# Altium project Robosub_PCB_thruster_board.PrjPcb
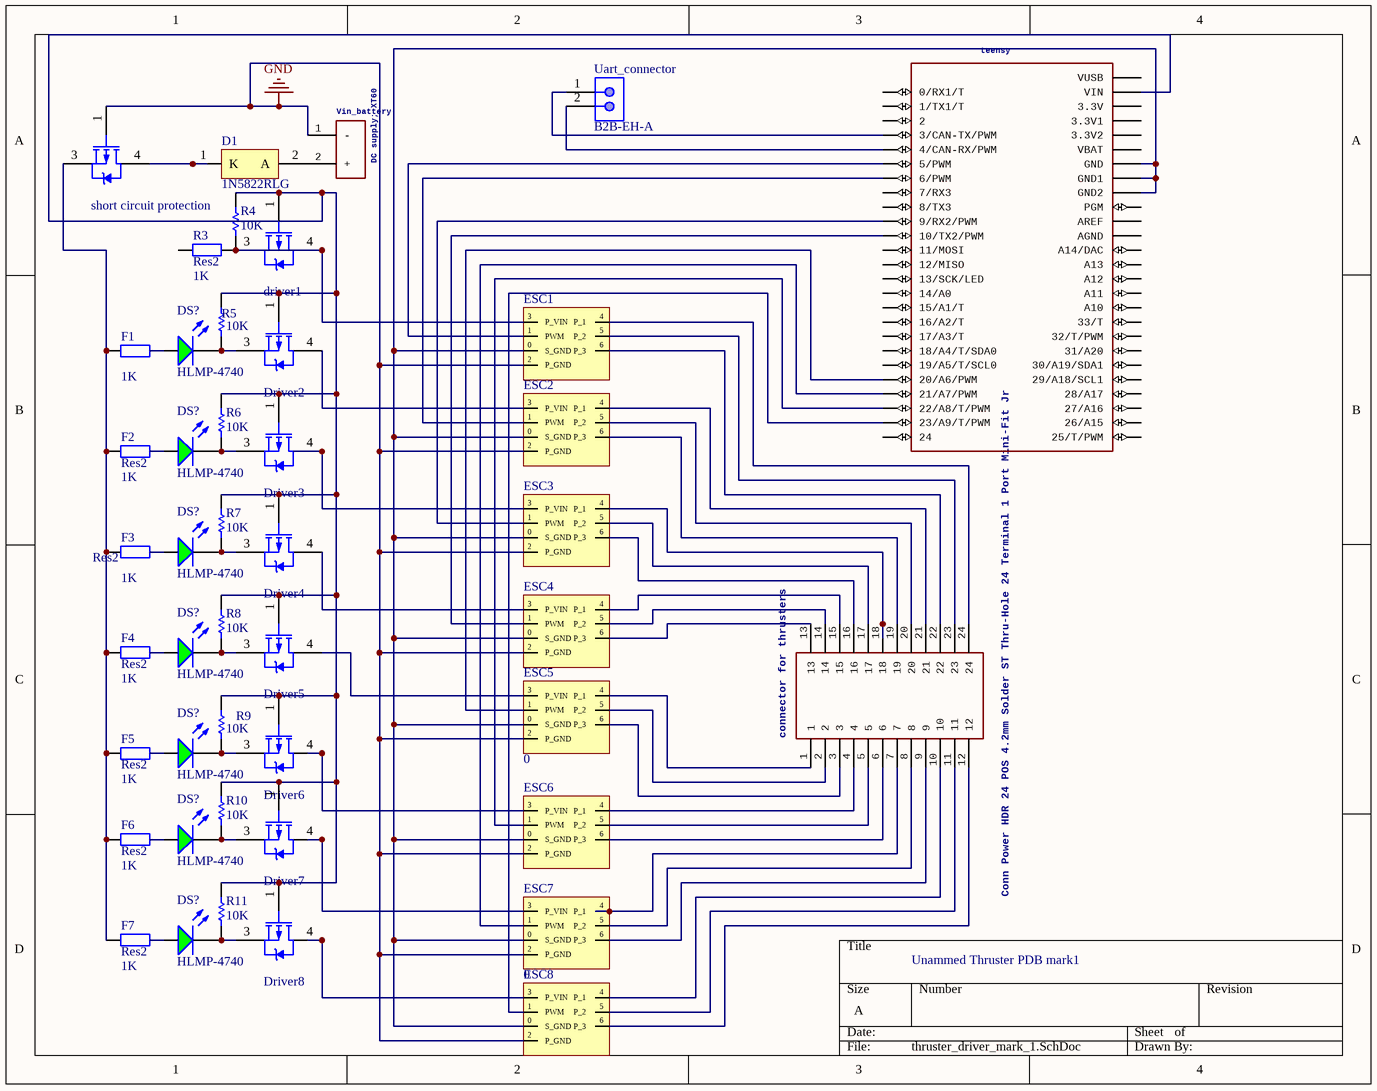
[diagram p0: thruster_driver_mark_1.SchDoc]
1 sheet, 45 parts. Net scope: global (net labels, ports and power ports of the same name join across sheets).
Board files: Thruster_driver_mark1.PcbDoc, Thruster_driver_mark2.PcbDoc

## Sheet thruster_driver_mark_1.SchDoc
size A

### Parts
(Parts that share a designator on the sheet are numbered #1, #2 ... from top to bottom, then left to right.)
connector_for_thrusters  Conn Power HDR 24 POS 4.2mm Solder ST Thru-Hole 24 Terminal 1 Port Mini-Fit Jr  [MOLEX_0039281243]
D1  1N5822RLG  [ONSC-AXIAL_LEAD-2-267-05_V]
driver1  MOSFET  [ONSC-DPAK-3-369C-01_V]  (value not drawn)
Driver2  MOSFET  [ONSC-DPAK-3-369C-01_V]  (value not drawn)
Driver3  MOSFET  [ONSC-DPAK-3-369C-01_V]  (value not drawn)
Driver4  MOSFET  [ONSC-DPAK-3-369C-01_V]  (value not drawn)
Driver5  MOSFET  [ONSC-DPAK-3-369C-01_V]  (value not drawn)
Driver6  MOSFET  [ONSC-DPAK-3-369C-01_V]  (value not drawn)
Driver7  MOSFET  [ONSC-DPAK-3-369C-01_V]  (value not drawn)
Driver8  MOSFET  [ONSC-DPAK-3-369C-01_V]  (value not drawn)
DS?#1  HLMP-4740  [AVAG-HLMP-4740]
DS?#2  HLMP-4740  [AVAG-HLMP-4740]
DS?#3  HLMP-4740  [AVAG-HLMP-4740]
DS?#4  HLMP-4740  [AVAG-HLMP-4740]
DS?#5  HLMP-4740  [AVAG-HLMP-4740]
DS?#6  HLMP-4740  [AVAG-HLMP-4740]
DS?#7  HLMP-4740  [AVAG-HLMP-4740]
ESC1  (no value)  [PCBComponent_1]
ESC2  (no value)  [PCBComponent_1]
ESC3  (no value)  [PCBComponent_1]
ESC4  (no value)  [PCBComponent_1]
ESC5  0  [PCBComponent_1]
ESC6  (no value)  [PCBComponent_1]
ESC7  0  [PCBComponent_1]
ESC8  (no value)  [PCBComponent_1]
F1  value 1K  [AXIAL-0.4]  (hidden comment: Fuse)
F2  Res2  value 1K  [AXIAL-0.4]
F3  Res2  value 1K  [AXIAL-0.4]
F4  Res2  value 1K  [AXIAL-0.4]
F5  Res2  value 1K  [AXIAL-0.4]
F6  Res2  value 1K  [AXIAL-0.4]
F7  Res2  value 1K  [AXIAL-0.4]
R3  Res2  value 1K  [AXIAL-0.4]
R4  10K  [RESC1609X55X30NL10T20]
R5  10K  [RESC1609X55X30NL10T20]
R6  10K  [RESC1609X55X30NL10T20]
R7  10K  [RESC1609X55X30NL10T20]
R8  10K  [RESC1609X55X30NL10T20]
R9  10K  [RESC1609X55X30NL10T20]
R10  10K  [RESC1609X55X30NL10T20]
R11  10K  [RESC1609X55X30NL10T20]
short_circuit_protection  MOSFET  [ONSC-DPAK-3-369C-01_V]  (value not drawn)
teensy  Footprint for Teensy 3.1 or 3.2 board using all pads and all through-holes. Pads need a 2x7 0.1" SMD header.  [TEENSY_3.0-3.2_ALL_PINS_&_PADS]  (value not drawn)
Uart_connector  B2B-EH-A  [JST-B2B-EH-A_V]
Vin_battery  DC supply; XT60  [AMASS_XT60-M]

### Nets
GND: ESC1.2(P_GND) ESC2.2(P_GND) ESC3.2(P_GND) ESC4.2(P_GND) ESC5.2(P_GND) ESC6.2(P_GND) ESC7.2(P_GND) ESC8.2(P_GND) short_circuit_protection.1(G) Vin_battery.1(-)
Netconnector_for_thrusters_1: connector_for_thrusters.1 ESC5.4(P_1)
Netconnector_for_thrusters_2: connector_for_thrusters.2 ESC5.5(P_2)
Netconnector_for_thrusters_3: connector_for_thrusters.3 ESC5.6(P_3)
Netconnector_for_thrusters_4: connector_for_thrusters.4 ESC6.4(P_1)
Netconnector_for_thrusters_5: connector_for_thrusters.5 ESC6.5(P_2)
Netconnector_for_thrusters_6: connector_for_thrusters.6 ESC6.6(P_3)
Netconnector_for_thrusters_7: connector_for_thrusters.7 ESC7.4(P_1)
Netconnector_for_thrusters_8: connector_for_thrusters.8 ESC7.5(P_2)
Netconnector_for_thrusters_9: connector_for_thrusters.9 ESC7.6(P_3)
Netconnector_for_thrusters_10: connector_for_thrusters.10 ESC8.4(P_1)
Netconnector_for_thrusters_11: connector_for_thrusters.11 ESC8.5(P_2)
Netconnector_for_thrusters_12: connector_for_thrusters.12 ESC8.6(P_3)
Netconnector_for_thrusters_13: connector_for_thrusters.13 ESC4.6(P_3)
Netconnector_for_thrusters_14: connector_for_thrusters.14 ESC4.5(P_2)
Netconnector_for_thrusters_15: connector_for_thrusters.15 ESC4.4(P_1)
Netconnector_for_thrusters_16: connector_for_thrusters.16 ESC3.6(P_3)
Netconnector_for_thrusters_17: connector_for_thrusters.17 ESC3.5(P_2)
Netconnector_for_thrusters_18: connector_for_thrusters.18 ESC3.4(P_1)
Netconnector_for_thrusters_19: connector_for_thrusters.19 ESC2.6(P_3)
Netconnector_for_thrusters_20: connector_for_thrusters.20 ESC2.5(P_2)
Netconnector_for_thrusters_21: connector_for_thrusters.21 ESC2.4(P_1)
Netconnector_for_thrusters_22: connector_for_thrusters.22 ESC1.6(P_3)
Netconnector_for_thrusters_23: connector_for_thrusters.23 ESC1.5(P_2)
Netconnector_for_thrusters_24: connector_for_thrusters.24 ESC1.4(P_1)
NetD1_1: D1.1(K) short_circuit_protection.4(D)
NetD1_2: D1.2(A) Vin_battery.2(+)
Netdriver1_1: driver1.1(G) Driver2.1(G) Driver3.1(G) Driver4.1(G) Driver5.1(G) Driver6.1(G) Driver7.1(G) Driver8.1(G) R4.1 R5.1 R6.1 R7.1 R8.1 R9.1 R10.1 R11.1 teensy.VIN
Netdriver1_3: driver1.3(S) driver1.4(D) ESC1.3(P_VIN) R3.2 R4.2
NetDriver2_3: Driver2.3(S) DS?#1.2(K) R5.2
NetDriver2_4: Driver2.4(D) ESC2.3(P_VIN)
NetDriver3_3: Driver3.3(S) DS?#2.2(K) R6.2
NetDriver3_4: Driver3.4(D) ESC3.3(P_VIN)
NetDriver4_3: Driver4.3(S) DS?#3.2(K) R7.2
NetDriver4_4: Driver4.4(D) ESC4.3(P_VIN)
NetDriver5_3: Driver5.3(S) DS?#4.2(K) R8.2
NetDriver5_4: Driver5.4(D) ESC5.3(P_VIN)
NetDriver6_3: Driver6.3(S) DS?#5.2(K) R9.2
NetDriver6_4: Driver6.4(D) ESC6.3(P_VIN)
NetDriver7_3: Driver7.3(S) DS?#6.2(K) R10.2
NetDriver7_4: Driver7.4(D) ESC7.3(P_VIN)
NetDriver8_3: Driver8.3(S) DS?#7.2(K) R11.2
NetDriver8_4: Driver8.4(D) ESC8.3(P_VIN)
NetDS?#1_1: DS?#1.1(A) F1.2
NetDS?#2_1: DS?#2.1(A) F2.2
NetDS?#3_1: DS?#3.1(A) F3.2
NetDS?#4_1: DS?#4.1(A) F4.2
NetDS?#5_1: DS?#5.1(A) F5.2
NetDS?#6_1: DS?#6.1(A) F6.2
NetDS?#7_1: DS?#7.1(A) F7.2
NetESC1_0: ESC1.0(S_GND) ESC2.0(S_GND) ESC3.0(S_GND) ESC4.0(S_GND) ESC5.0(S_GND) ESC6.0(S_GND) ESC7.0(S_GND) ESC8.0(S_GND) teensy.GND teensy.GND1 teensy.GND2
NetESC1_1: ESC1.1(PWM) teensy.5(5/PWM)
NetESC2_1: ESC2.1(PWM) teensy.6(6/PWM)
NetESC3_1: ESC3.1(PWM) teensy.9(9/RX2/PWM)
NetESC4_1: ESC4.1(PWM) teensy.10(10/TX2/PWM)
NetESC5_1: ESC5.1(PWM) teensy.20/A6(20/A6/PWM)
NetESC6_1: ESC6.1(PWM) teensy.22/A8(22/A8/T/PWM)
NetESC7_1: ESC7.1(PWM) teensy.21/A7(21/A7/PWM)
NetESC8_1: ESC8.1(PWM) teensy.23/A9(23/A9/T/PWM)
NetF1_1: F1.1 F2.1 F3.1 F4.1 F5.1 F6.1 F7.1 short_circuit_protection.3(S)
Netteensy_3: teensy.3(3/CAN-TX/PWM) Uart_connector.1
Netteensy_4: teensy.4(4/CAN-RX/PWM) Uart_connector.2

Not connected (* = marked no-connect by the designer): R3 1; teensy 0(0/RX1/T) 1(1/TX1/T) 2 3.3V1 (3.3V1) 3.3V2 3.3V (3.3V) 7(7/RX3) 8(8/TX3) 11(11/MOSI) 12(12/MISO) 13(13/SCK/LED) 14/A0 15/A1(15/A1/T) 16/A2(16/A2/T) 17/A3(17/A3/T) 18/A4(18/A4/T/SDA0) 19/A5(19/A5/T/SCL0) 24 25(25/T/PWM) 26(26/A15) 27(27/A16) 28(28/A17) 29(29/A18/SCL1) 30(30/A19/SDA1) 31(31/A20) 32(32/T/PWM) 33(33/T) A10 A11 A12 A13 AGND AREF PGM RESET/DAC(A14/DAC) VBAT VUSB

### Notes on the sheet
- Unammed Thruster PDB mark1

### Library data of the parts
connector_for_thrusters = 0039281243: GateName_1: G$1; MF: Molex; SymbolName_1: 0039281243; LibraryName: 0039281243; DeviceSetName: 0039281243; Package: MOLEX_0039281243; DIGI-KEY_PART_NUMBER: WM3811-ND; DIGI-KEY_PURCHASE_URL: https://www.digikey.com/product-detail/en/molex/0039281243/WM3811-ND/356033?utm_source=snapeda&utm_medium=aggregator&utm_campaign=symbol; MP: 0039281243; PACKAGE: None
D1 = CMP-1055-00010-1: Rectifier, 2-Pin Axial_Lead, Pb-Free, Tape and Reel; Manufacturer: On Semiconductor; Configuration: Single; IFSM Max (A): 80; ComponentLink2URL: http://www.onsemi.cn/pub_link/Collateral/1N5820-D.PDF; Packing: Tape and Reel; ComponentLink1Description: Manufacturer URL; PackageDescription: 2-Pin, Axial Lead, Diameter 5.05 mm; ComponentLink3Description: Package Specification; PackageReference: AXIAL_LEAD-2-267-05; PartNumber: 1N5822RLG; PackageVersion: Rev. G, 06/2000; ComponentLink1URL: http://www.onsemi.com/; ComponentLink2Description: Datasheet; RoHS: TRUE; Mounting Technology: Through Hole; DatasheetVersion: Rev. 10; ComponentLink3URL: http://www.onsemi.com/pub_link/Collateral/267-05.PDF
driver1 Driver2-Driver8 short_circuit_protection = CMP-1058-00407-1: Power MOSFET -60 V, -15.5 A, Single P-Channel, 3-Pin DPAK, Pb-Free, Tape and Reel; PartNumber: NTD20P06LT4G; Manufacturer: On Semiconductor; V(BR)DSS Min (V): 60; Channel Polarity: P Channel; VGS Max (V): 20; Ciss Typ (pF): 740; ID Max (A): 15.5; PD Max (W): 65; Coss Typ (pF): 207; VGS(th) Max (V): 2; Qrr Typ (nC): 0.13; Crss Typ (pF): 66; ComponentLink1URL: http://www.onsemi.com/; ComponentLink1Description: Manufacturer URL; Configuration: Single; ComponentLink2URL: http://www.onsemi.cn/pub_link/Collateral/NTD20P06L-D.PDF; ComponentLink3Description: Package Specification; Mounting Technology: Surface Mount; RoHS: Pb-Free; ComponentLink3URL: http://www.onsemi.cn/pub_link/Collateral/369C.PDF; PackageVersion: Rev. E, 02/2014; Packing: Tape and Reel; DatasheetVersion: Rev. 6; PackageReference: DPAK-3-369C-01; PackageDescription: 3-Pin Flange Mount, Body 6.54 x 6.095 mm, Pitch 2.29 mm; ComponentLink2Description: Datasheet; Package Type: DPAK-3
DS?#1-DS?#7 = CMP-2000-06413-1: T-1 3/4 (5 mm) Low Current LED Lamp, Green, 1.9 V, -20 to 100 degC, 2-Pin THD, RoHS, Bulk; Manufacturer: AvagoTechnologies; Type: Uni-Color; Peak Wavelength: 565nm; Rad Hard: No; Viewing Angle: 50°; Dominant Wavelength/Color Temperature: 569nm; Number of LEDs: 1; Lens Appearance: ColoredDiffused; Lens Shape Type: Circular; Mounting Orientation: TopMount; Intensity: 2.3mcd; Datasheet Version: 07/2014; Category: LEDs; Datasheet URL: http://docs.avagotech.com/docs/AV02-1557EN; Packaging: Bulk; Pin Count: 2; Mounting Technology: ThroughHole; Package Reference: HLMP-4740; Mounting: ThroughHole; Manufacturer URL: http://www.avagotech.com/; Color: Green; Package: 2T-13/4; Package Description: 2-Pin Through Hole Device, Dia 5.845 mm, Pitch 2.54 mm
ESC1-ESC8 = ESC_1: this is just a footprint made for the esc to allow a interface, where the esc can be on the board
F1-F7 R3 = Res2: Resistor; Published: 8-Jun-2000; LatestRevisionDate: 17-Jul-2002; LatestRevisionNote: Re-released for DXP Platform.; PackageReference: AXIAL-0.4; Publisher: Altium Limited; PackageDescription: Axial Device, Thru-Hole; 2 Leads; 0.4 in Pin Spacing
R4-R11 = CMP-2000-03691-1: Manufacturer: Vishay Dale; Part Number: TNPW060310K0BEEA
teensy = TEENSY_3.1-3.2_ALL_PINS&PADS: GateName_1: G$1; SymbolName_1: TEENSY_3.1-3.2_ALL_PINS_AND_PADS; LibraryName: Teensy_3_and_LC_Series_Boards_v1.4; DeviceSetName: TEENSY_3.1-3.2_ALL_PINS&PADS; Package: TEENSY_3.0-3.2_ALL_PINS_&_PADS
Uart_connector = CMP-2000-05887-1: Male Header, Pitch 2.5 mm, 1 x 2 Position, Height 6 mm, Tail Length 3.2 mm, -25 to 85 degC, RoHS, Bulk; Manufacturer: JST; Other Names: 455-1014; Mating Products: 455-1000-ND-CONNHOUSINGEH2POS2.5MMCRIMP455-2933-ND-CONNRECEPTHR2POS2.5MMBLACK455-2934-ND-CONNRECEPTHR2POS2.5MMWHITE455-1044-ND-CONNRECEPTHR2POS2.5MMWHITE455-1057-ND-CONNRECEPTHR2POS2.5MMBLACK; Pitch: 0.098"(2.50mm); Connector Type: Header,Shrouded; Number of Positions: 2; Number of Positions Loaded: All; Manufacturer URL: http://www.jst.com/home2.html; Contact Type: MalePin; Package Description: Male Header, Pitch 2.5 mm, 1 x 2 Position, Height 6 mm, Tail Length 3.2 mm; Mounting Type: ThroughHole; Mounting Technology: ThroughHole; Number of Rows: 1; Features: -; Fastening Type: DetentLock; Contact Finish Thickness: -; Datasheet Version: 10/2002; Termination: Press-Fit; Datasheet URL: http://media.digikey.com/pdf/Data%20Sheets/JST%20PDFs/EH%20Series.pdf; Standard Package: 1,000; Category: Connectors,Interconnects; Family: RectangularConnectors-Headers,MalePins; Contact Finish: Tin-Lead; Packaging: Bulk; Color: Natural; Package Reference: B2B-EH-A; Row Spacing: -; Contact Mating Length: 0.130"(3.30mm); Series: EH
Vin_battery = XT60-M: GateName_1: G$1; MF: AMASS; SymbolName_1: XT60-M; LibraryName: XT60-M; DeviceSetName: XT60-M; Package: AMASS_XT60-M; AVAILABILITY: Unavailable; MP: XT60-M; PACKAGE: Package Analog Devices; PRICE: None